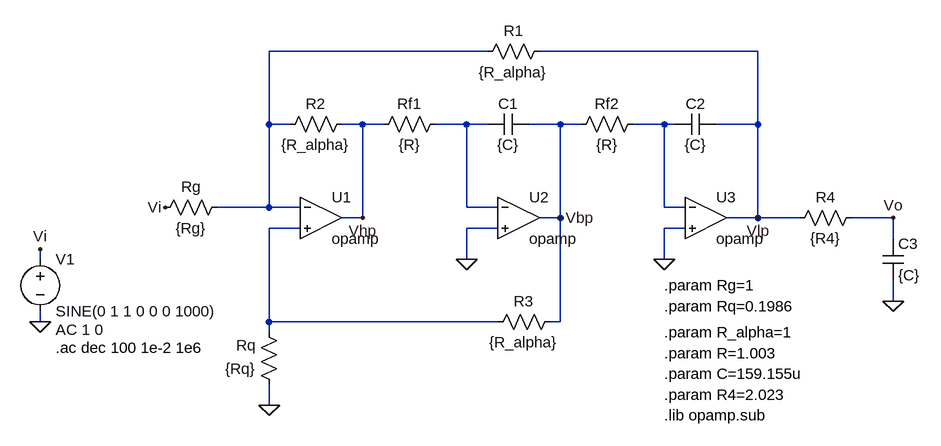
[diagram p0: schematic khn.asc]
khn.asc, the LTspice schematic file:
Version 4
SHEET 1 1080 680
WIRE 400 -48 64 -48
WIRE 816 -48 480 -48
WIRE 64 64 64 -48
WIRE 96 64 64 64
WIRE 208 64 176 64
WIRE 240 64 208 64
WIRE 368 64 320 64
WIRE 400 64 368 64
WIRE 512 64 464 64
WIRE 544 64 512 64
WIRE 672 64 624 64
WIRE 688 64 672 64
WIRE 816 64 816 -48
WIRE 816 64 752 64
WIRE 64 192 64 64
WIRE 64 192 -16 192
WIRE 112 192 64 192
WIRE 368 192 368 64
WIRE 416 192 368 192
WIRE 672 192 672 64
WIRE 704 192 672 192
WIRE 208 208 208 64
WIRE 208 208 176 208
WIRE 512 208 512 64
WIRE 512 208 480 208
WIRE 816 208 816 64
WIRE 816 208 768 208
WIRE 880 208 816 208
WIRE 1024 208 960 208
WIRE 112 224 64 224
WIRE 416 224 368 224
WIRE 704 224 672 224
WIRE 1024 240 1024 208
WIRE -288 272 -288 256
WIRE 368 272 368 224
WIRE 672 272 672 224
WIRE 1024 336 1024 304
WIRE -288 368 -288 352
WIRE 64 368 64 224
WIRE 416 368 64 368
WIRE 512 368 512 208
WIRE 512 368 496 368
WIRE 64 384 64 368
WIRE 64 496 64 464
FLAG 64 496 0
FLAG 368 272 0
FLAG 672 272 0
FLAG -96 192 Vi
FLAG 208 208 Vhp
FLAG 512 208 Vbp
FLAG 816 208 Vlp
FLAG -288 368 0
FLAG -288 256 Vi
FLAG 1024 336 0
FLAG 1024 208 Vo
SYMBOL res 0 176 R90
WINDOW 0 0 56 VBottom 2
WINDOW 3 32 56 VTop 2
SYMATTR InstName Rg
SYMATTR Value {Rg}
SYMBOL Opamps\\opamp 144 144 R0
SYMATTR InstName U1
SYMBOL Opamps\\opamp 448 144 R0
SYMATTR InstName U2
SYMBOL Opamps\\opamp 736 144 R0
SYMATTR InstName U3
SYMBOL res 192 48 R90
WINDOW 0 0 56 VBottom 2
WINDOW 3 32 56 VTop 2
SYMATTR InstName R2
SYMATTR Value {R_alpha}
SYMBOL res 336 48 R90
WINDOW 0 0 56 VBottom 2
WINDOW 3 32 56 VTop 2
SYMATTR InstName Rf1
SYMATTR Value {R}
SYMBOL res 640 48 R90
WINDOW 0 0 56 VBottom 2
WINDOW 3 32 56 VTop 2
SYMATTR InstName Rf2
SYMATTR Value {R}
SYMBOL res 496 -64 R90
WINDOW 0 0 56 VBottom 2
WINDOW 3 32 56 VTop 2
SYMATTR InstName R1
SYMATTR Value {R_alpha}
SYMBOL res 512 352 R90
WINDOW 0 0 56 VBottom 2
WINDOW 3 32 56 VTop 2
SYMATTR InstName R3
SYMATTR Value {R_alpha}
SYMBOL res 80 480 R180
WINDOW 0 36 76 Left 2
WINDOW 3 36 40 Left 2
SYMATTR InstName Rq
SYMATTR Value {Rq}
SYMBOL cap 464 48 R90
WINDOW 0 0 32 VBottom 2
WINDOW 3 32 32 VTop 2
SYMATTR InstName C1
SYMATTR Value {C}
SYMBOL cap 752 48 R90
WINDOW 0 0 32 VBottom 2
WINDOW 3 32 32 VTop 2
SYMATTR InstName C2
SYMATTR Value {C}
SYMBOL voltage -288 256 R0
WINDOW 123 24 124 Left 2
WINDOW 39 0 0 Left 0
SYMATTR InstName V1
SYMATTR Value SINE(0 1 1 0 0 0 1000)
SYMATTR Value2 AC 1 0
SYMBOL res 976 192 R90
WINDOW 0 0 56 VBottom 2
WINDOW 3 32 56 VTop 2
SYMATTR InstName R4
SYMATTR Value {R4}
SYMBOL cap 1008 240 R0
SYMATTR InstName C3
SYMATTR Value {C}
TEXT 672 312 Left 2 !.param Rg=1
TEXT 672 344 Left 2 !.param Rq=0.1986
TEXT 672 384 Left 2 !.param R_alpha=1
TEXT 672 416 Left 2 !.param R=1.003
TEXT 672 448 Left 2 !.param C=159.155u
TEXT 672 512 Left 2 !.lib opamp.sub
TEXT -264 408 Left 2 !.ac dec 100 1e-2 1e6
TEXT 672 480 Left 2 !.param R4=2.023

The netlist it stands for:
* khn.asc
Rg N001 Vi {Rg}
XU1 N001 N004 Vhp opamp Aol=100K GBW=10Meg  ; pins invin noninvin out
XU2 N002 0 Vbp opamp Aol=100K GBW=10Meg  ; pins invin noninvin out
XU3 N003 0 Vlp opamp Aol=100K GBW=10Meg  ; pins invin noninvin out
R2 Vhp N001 {R_alpha}
Rf1 N002 Vhp {R}
Rf2 N003 Vbp {R}
R1 Vlp N001 {R_alpha}
R3 Vbp N004 {R_alpha}
Rq 0 N004 {Rq}
C1 Vbp N002 {C}
C2 Vlp N003 {C}
V1 Vi 0 SINE(0 1 1 0 0 0 1000) AC 1 0
R4 Vo Vlp {R4}
C3 Vo 0 {C}
.param Rg=1
.param Rq=0.1986
.param R_alpha=1
.param R=1.003
.param C=159.155u
.lib opamp.sub
.ac dec 100 1e-2 1e6
.param R4=2.023
.backanno
.end